# EAGLE schematic kossr2 (EAGLE 6.3)
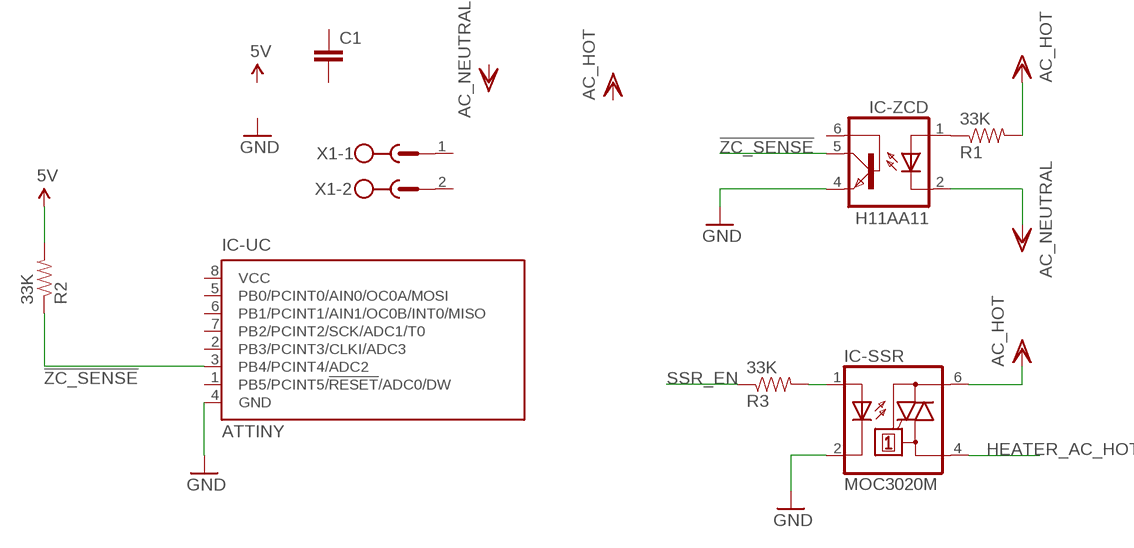
[diagram p0: schematic, sheet 1]

## Parts
C1  CAPPTH  [CAP-PTH-SMALL]
IC-SSR  MOC3020M  [DIL06]
IC-UC  ATTINY  TINY13V-10PU  [DIL08]
IC-ZCD  H11AA11  [DIL06]
R1  33K  RESISTORPTH-1/4W  [AXIAL-0.4]
R2  33K  RESISTORPTH-1/4W  [AXIAL-0.4]
R3  33K  RESISTORPTH-1/4W  [AXIAL-0.4]
X1  MSTBV2  [MSTBV2]

## Nets
5V: R2.P$2
!ZC_SENSE: IC-UC.3(PB4/PCINT4/ADC2) IC-ZCD.5(COL) R2.P$1
AC_NEUTRAL: IC-ZCD.2(C)
GND: IC-SSR.2(C) IC-UC.4(GND) IC-ZCD.4(EMI)
HEATER_AC_HOT: IC-SSR.4(A1)
N$1: IC-ZCD.1(A) R1.P$1
N$3: IC-SSR.1(A) R3.P$2
SSR_EN: R3.P$1
VDD: IC-SSR.6(A2) R1.P$2 ; supply symbol labelled AC_HOT
Unconnected: C1.1 C1.2 IC-UC.1(PB5/PCINT5/!RESET!/ADC0/DW) IC-UC.2(PB3/PCINT3/CLKI/ADC3) IC-UC.5(PB0/PCINT0/AIN0/OC0A/MOSI) IC-UC.6(PB1/PCINT1/AIN1/OC0B/INT0/MISO) IC-UC.7(PB2/PCINT2/SCK/ADC1/T0) IC-ZCD.6(BAS) X1.1 X1.2

## Power pins joined to a net without a drawn wire
VCC: IC-UC.8(VCC)

## Library data of the parts
C1 = SparkFun-Passives:CAP: Capacitor Standard 0603 ceramic capacitor, and 0.1" leaded capacitor.
IC-SSR = optocoupler:MOC30*M: RANDOM-PHASE OPTOISOLATORS TRIAC DRIVER OUTPUT Source: http://www.fairchildsemi.com MOC3020-M.pdf; MF: FAIRCHILD SEMICONDUCTOR; MPN: MOC3020-M; OC_FARNELL: 1505425; OC_NEWARK: 72K8895
IC-UC = atmel:TINY13: 8-bit AVR Microcontroller with 1K Bytes In-System Programmable Flash Source: http://www.atmel.com/dyn/resources/prod_documents/2535S.pdf; MPN: ATTINY13V-10PU; OC_FARNELL: 9171576; OC_NEWARK: 96K6523
IC-ZCD = twomey:H11AA1: Optocoupler AC Input 1 Channel Trans W/Base DC Output 6-Pin DIP Source: http://www.jameco.com/webapp/wcs/stores/servlet/Product_10001_10001_18825_-1; MPN: H11A1-M; OC_FARNELL: 1021358; OC_NEWARK: 97K1793
R1-R3 = SparkFun-Passives:RESISTOR: Resistor Basic schematic elements and footprints for 0603, 1206, and PTH resistors.
X1 = con-phoenix-500:MSTBV2: PHOENIX; OC_FARNELL: unknown; OC_NEWARK: unknown